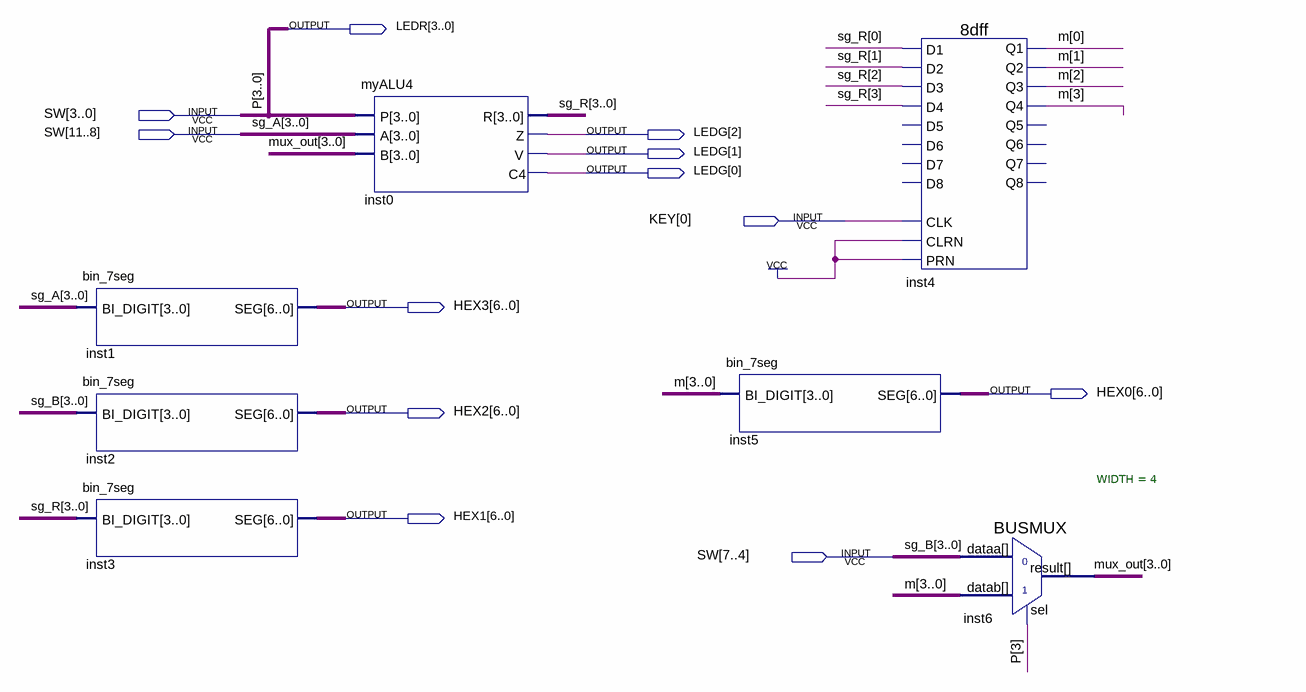
[diagram p0: schematic sheet]
// Quartus schematic Lab6.bdf as structural Verilog: 7 symbols, 12 pins
module Lab6 (
  input  [11:0] SW,
  input  [0:0] KEY,
  output [3:0] LEDR,
  output [2:0] LEDG,
  output [6:0] HEX3,
  output [6:0] HEX0,
  output [6:0] HEX2,
  output [6:0] HEX1
);

  wire [3:0] m, mux_out, sg_R;

  bin_7seg inst1 (.BI_DIGIT(SW[11:8]), .SEG(HEX3));
  bin_7seg inst2 (.BI_DIGIT(SW[7:4]), .SEG(HEX2));
  bin_7seg inst3 (.BI_DIGIT(sg_R), .SEG(HEX1));
  myALU4 inst0 (.P(SW[3:0]), .A(SW[11:8]), .B(mux_out), .R(sg_R), .Z(LEDG[2]), .V(LEDG[1]), .C4(LEDG[0]));
  bin_7seg inst5 (.BI_DIGIT(m), .SEG(HEX0));
  \8dff  inst4 (
    .D4(sg_R[3]), .D3(sg_R[2]), .PRN(1'b1), .CLK(KEY[0]), .CLRN(1'b1), .D2(sg_R[1]), .D1(sg_R[0]), .Q1(m[0]),
    .Q4(m[3]), .Q3(m[2]), .Q2(m[1]));  // open: D5, D8, D7, D6, Q8, Q5, Q6, Q7
  BUSMUX #(.WIDTH(4)) inst6 (.datab(m), .sel(SW[3]), .dataa(SW[7:4]), .result(mux_out));

  assign LEDR = SW[3:0];

  // Other names for the same wires on the sheet: P[3:0] = SW[3:0]; sg_A[3:0] = SW[11:8]; sg_B[3:0] = SW[7:4]
endmodule
